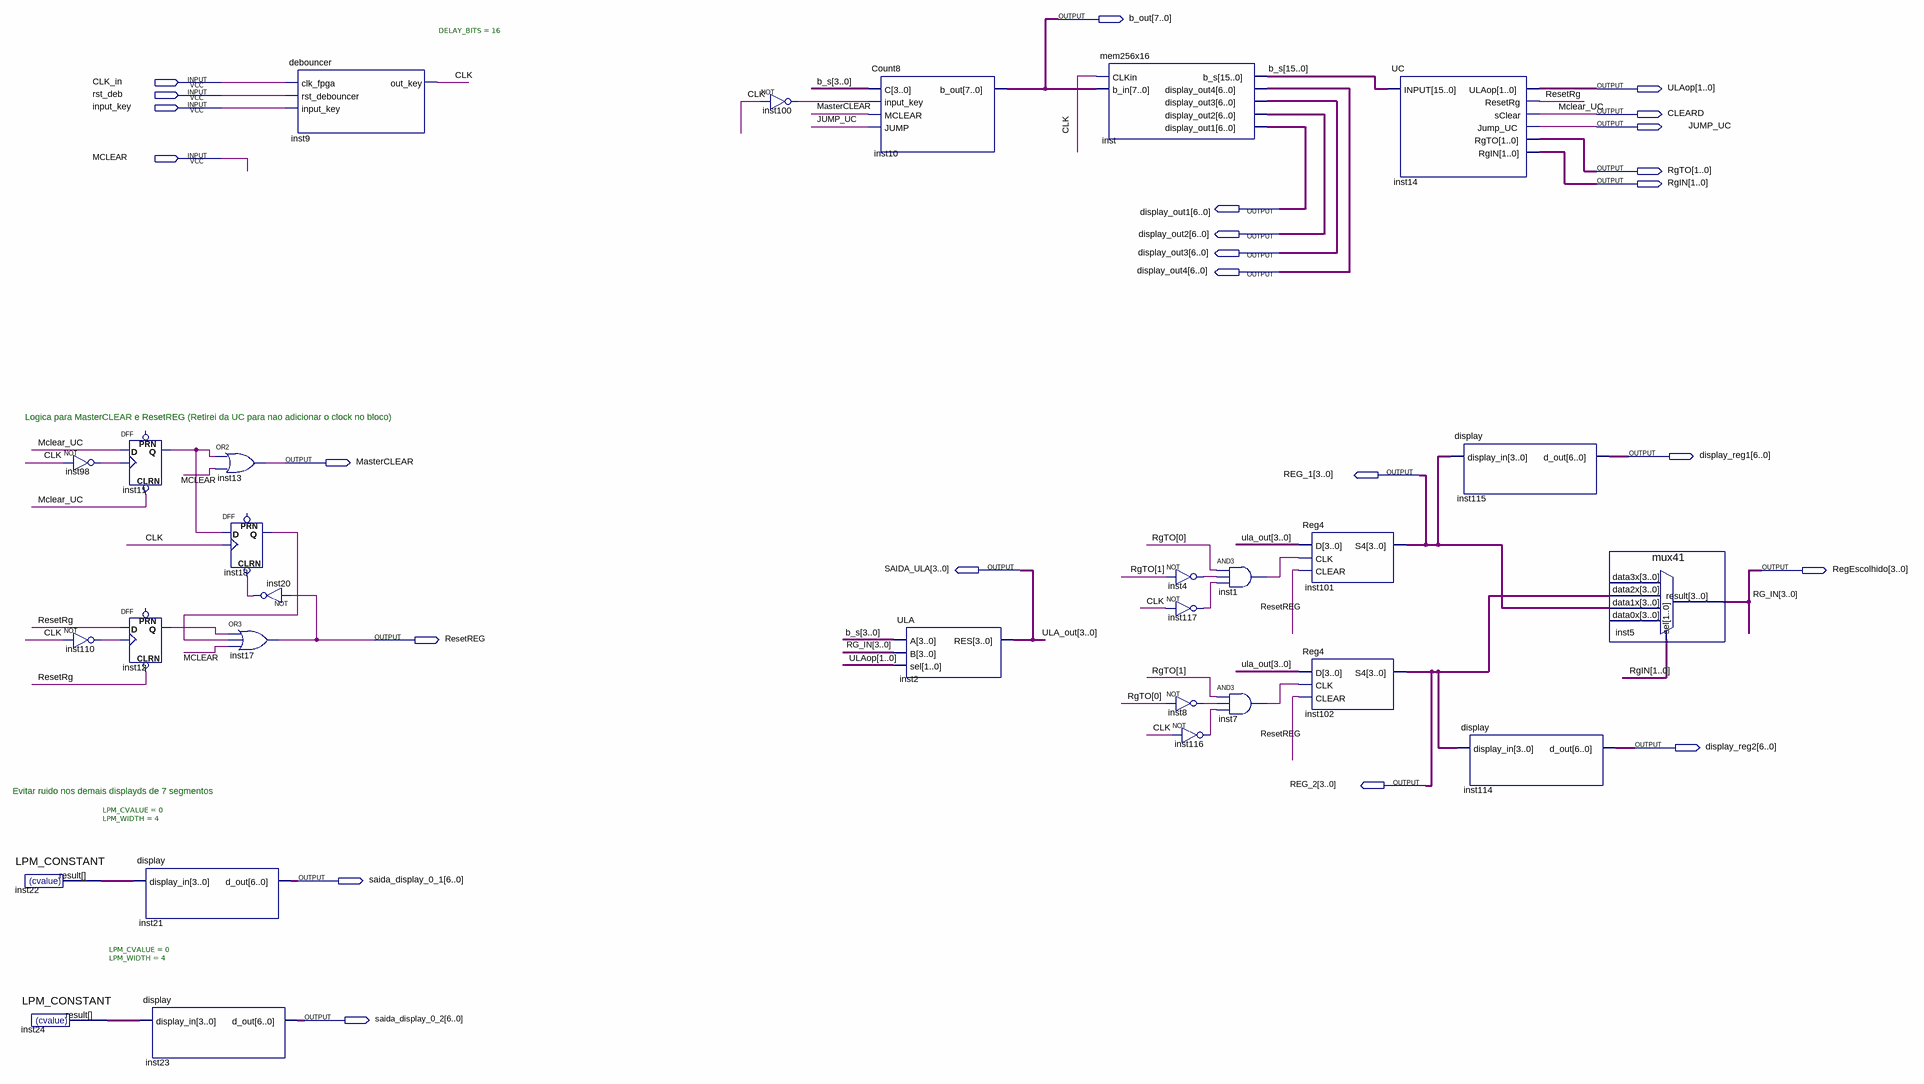
[diagram p0: schematic sheet]
// Quartus schematic CPU.bdf as structural Verilog: 29 symbols, 24 pins
module CPU (
  input  CLK_in,
  input  rst_deb,
  input  input_key,
  input  MCLEAR,
  output [7:0] b_out,
  output [1:0] ULAop,
  output CLEARD,
  output JUMP_UC,
  output [1:0] RgTO,
  output [1:0] RgIN,
  output [6:0] display_out1,
  output [6:0] display_out2,
  output [6:0] display_out3,
  output [6:0] display_out4,
  output [6:0] display_reg1,
  output MasterCLEAR,
  output [3:0] REG_1,
  output [3:0] SAIDA_ULA,
  output [3:0] RegEscolhido,
  output ResetREG,
  output [6:0] display_reg2,
  output [3:0] REG_2,
  output [6:0] saida_display_0_1,
  output [6:0] saida_display_0_2
);

  wire CLK, inst1_out, inst4_out, inst7_out, inst8_out, inst11_q, inst12_q, inst18_q, inst20_out, inst98_out,
       inst100_out, inst110_out, inst116_out, inst117_out, ResetRg;
  wire [3:0] inst22_result, inst24_result;
  wire [15:0] b_s;

  LPM_CONSTANT #(.LPM_CVALUE(0), .LPM_WIDTH(4)) inst22 (.result(inst22_result));
  LPM_CONSTANT #(.LPM_CVALUE(0), .LPM_WIDTH(4)) inst24 (.result(inst24_result));
  not inst98 (inst98_out, CLK);
  not inst110 (inst110_out, CLK);
  DFF inst11 (.CLRN(CLEARD), .CLK(inst98_out), .D(CLEARD), .Q(inst11_q));  // open: PRN
  DFF inst12 (.CLRN(ResetRg), .CLK(inst110_out), .D(ResetRg), .Q(inst12_q));  // open: PRN
  display inst21 (.display_in(inst22_result), .d_out(saida_display_0_1));
  display inst23 (.display_in(inst24_result), .d_out(saida_display_0_2));
  or inst13 (MasterCLEAR, inst11_q, MCLEAR);
  DFF inst18 (.CLRN(inst20_out), .CLK(CLK), .D(inst11_q), .Q(inst18_q));  // open: PRN
  or inst17 (ResetREG, inst12_q, inst18_q, MCLEAR);
  not inst20 (inst20_out, ResetREG);
  debouncer #(.DELAY_BITS(16)) inst9 (.clk_fpga(CLK_in), .rst_debouncer(rst_deb), .input_key(input_key), .out_key(CLK));
  not inst100 (inst100_out, CLK);
  Count8 inst10 (.C(b_s[3:0]), .input_key(inst100_out), .MCLEAR(MasterCLEAR), .JUMP(JUMP_UC), .b_out(b_out));
  ULA inst2 (.A(b_s[3:0]), .B(RegEscolhido), .sel(ULAop), .RES(SAIDA_ULA));
  mem256x16 inst (
    .CLKin(CLK), .b_in(b_out), .b_s(b_s), .display_out4(display_out4), .display_out3(display_out3),
    .display_out2(display_out2), .display_out1(display_out1));
  not inst4 (inst4_out, RgTO[1]);
  not inst117 (inst117_out, CLK);
  not inst8 (inst8_out, RgTO[0]);
  not inst116 (inst116_out, CLK);
  and inst1 (inst1_out, RgTO[0], inst4_out, inst117_out);
  and inst7 (inst7_out, RgTO[1], inst8_out, inst116_out);
  Reg4 inst101 (.D(SAIDA_ULA), .CLK(inst1_out), .CLEAR(ResetREG), .S4(REG_1));
  Reg4 inst102 (.D(SAIDA_ULA), .CLK(inst7_out), .CLEAR(ResetREG), .S4(REG_2));
  UC inst14 (
    .INPUT(b_s), .ULAop(ULAop), .ResetRg(ResetRg), .sClear(CLEARD), .Jump_UC(JUMP_UC), .RgTO(RgTO),
    .RgIN(RgIN));
  display inst115 (.display_in(REG_1), .d_out(display_reg1));
  display inst114 (.display_in(REG_2), .d_out(display_reg2));
  mux41 inst5 (.data2x(REG_2), .data1x(REG_1), .sel(RgIN), .result(RegEscolhido));  // open: data3x, data0x

  // Other names for the same wires on the sheet: Mclear_UC = CLEARD; RG_IN[3:0] = RegEscolhido;
  //   ula_out[3:0] = SAIDA_ULA

  // Notes on the sheet:
  //   Logica para MasterCLEAR e ResetREG (Retirei da UC para nao adicionar o clock no bloco)
  //   Evitar ruido nos demais displayds de 7 segmentos
endmodule
